# EAGLE design p4_joint (EAGLE 9.6.2)
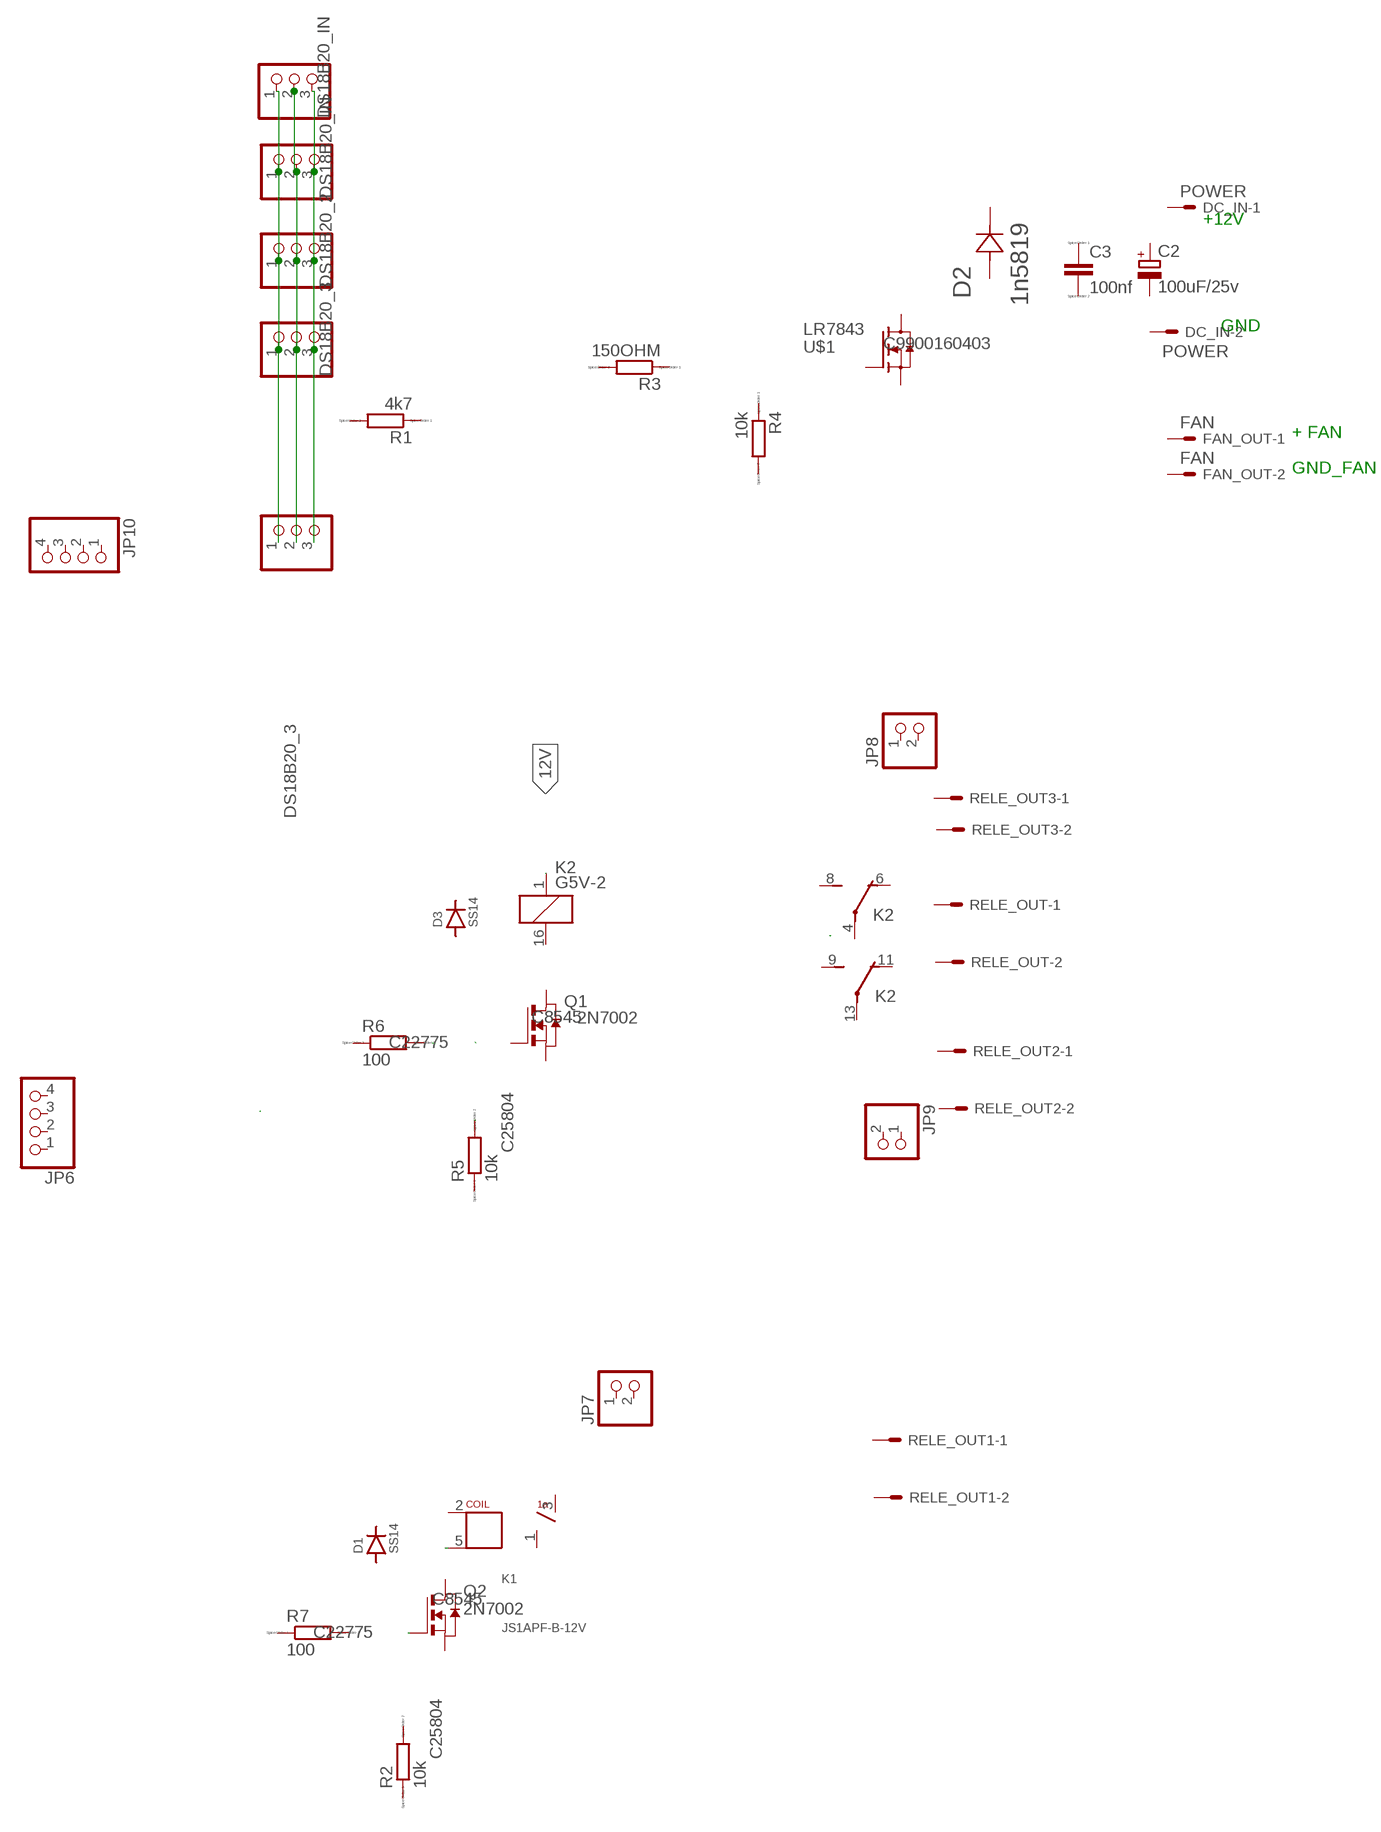
[diagram p0: schematic, sheet 1]

## Parts
C2  100uF/25v  CPOL-EUC  [PANASONIC_C]
C3  100nf  CC0603  [C0603]
D1  SS14  [SMA]
D2  1n5819  1N4148W-7-FSOD123-M  [SOD123-M]
D3  SS14  [SMA]
DC_IN  POWER  KK-156-2  [KK-156-2]
FAN_OUT  FAN  KK-156-2  [KK-156-2]
JP1  DS18B20_IN  PINHD-1X3  [1X03]
JP2  DS18B20_IN  PINHD-1X3  [1X03]
JP3  DS18B20_3  PINHD-1X3  [1X03]
JP4  DS18B20_2  PINHD-1X3  [1X03]
JP5  DS18B20_3  PINHD-1X3  [1X03]
JP6  PINHD-1X4  [1X04]
JP7  PINHD-1X2  [1X02]
JP8  PINHD-1X2  [1X02]
JP9  PINHD-1X2  [1X02]
JP10  PINHD-1X4  [1X04]
K1  JS1APF-B-12V  [JS_RELAY_1A]
K2  G5V-2  [G5V-2]
Q1  2N7002  NMOSSOT23  [SOT-23]
Q2  2N7002  NMOSSOT23  [SOT-23]
R1  4k7  RR0603  [R0603]
R2  10k  R  [R0805]
R3  150OHM  RR0603  [R0603]
R4  10k  RR0603  [R0603]
R5  10k  R  [R0805]
R6  100  R  [R0805]
R7  100  R  [R0805]
RELE_OUT  KK-156-2  [KK-156-2]
RELE_OUT1  KK-156-2  [KK-156-2]
RELE_OUT2  KK-156-2  [KK-156-2]
RELE_OUT3  KK-156-2  [KK-156-2]
U$1  LR7843  IRLR7843  [TO252]

## Nets
12V: K2.1
N$2: JP1.3 JP2.3 JP3.3 JP4.3 JP5.3
N$5: R5.2
N$6: Q2.3(G)
N$11: R6.2
N$12: K1.5(C2)
N$21: JP1.2 JP2.2 JP3.2 JP4.2 JP5.2
N$22: JP1.1 JP2.1 JP3.1 JP4.1 JP5.1
Unconnected: C2.+ C2.- C3.1 C3.2 D1.A D1.C D2.A D2.C D3.A D3.C DC_IN.1 DC_IN.2 FAN_OUT.1 FAN_OUT.2 JP6.1 JP6.2 JP6.3 JP6.4 JP7.1 JP7.2 JP8.1 JP8.2 JP9.1 JP9.2 JP10.1 JP10.2 JP10.3 JP10.4 K1.1(COM) K1.2(C1) K1.3(NO) K2.4(1:P) K2.6(1:O) K2.8(1:S) K2.9(2:S) K2.11(2:O) K2.13(2:P) K2.16 Q1.1(D) Q1.2(S) Q1.3(G) Q2.1(D) Q2.2(S) R1.1 R1.2 R2.1 R2.2 R3.1 R3.2 R4.1 R4.2 R5.1 R6.1 R7.1 R7.2 RELE_OUT1.1 RELE_OUT1.2 RELE_OUT2.1 RELE_OUT2.2 RELE_OUT3.1 RELE_OUT3.2 RELE_OUT.1 RELE_OUT.2 U$1.1(G) U$1.2(S) U$1.3(D)

## Notes on the sheet
- +12V
- GND
- + FAN
- GND_FAN

## Library data of the parts
C2 = rcl:CPOL-EU: POLARIZED CAPACITOR, European symbol; SPICEPREFIX: C
C3 = eagle-ltspice:C: CAPACITOR, European symbol; SPICEMODEL: NONE; SPICEPREFIX: C
D1 D3 = p4_joint_add:SS14: Schottky 1A/40V SMA (DO-214AC). JLCPCB LCSC C2480 (basica). Catodo = pad C (banda).; LCSC: C2480
D2 = 1N4148W:1N4148W-7-F; COPYRIGHT: Copyright C 2015 Accelerated Designs. All rights reserved; MANUFACTURER_PART_NUMBER: 1N4148W7F; VENDOR: Diodes Inc
DC_IN FAN_OUT RELE_OUT RELE_OUT1-RELE_OUT3 = con-molex:KK-156-2: KK 156 HEADER Source: http://www.molex.com/pdm_docs/sd/026604100_sd.pdf; MF: MOLEX; OC_FARNELL: unknown; OC_NEWARK: unknown
JP1-JP5 = pinhead:PINHD-1X3: PIN HEADER
JP6 JP10 = pinhead:PINHD-1X4: PIN HEADER
JP7-JP9 = pinhead:PINHD-1X2: PIN HEADER
K1 = p4_joint_add:JS1APF-B-12V: Rele Panasonic JS1aPF-B-12V, 1 Form A. Bobina 12V/400ohm/30mA. THT, a mano. FOOTPRINT PROVISIONAL.
K2 = relay:G5V-2: OMRON PCB Relay Source: http://www.omron.com/ecb/products/pdf/en-g5v2.pdf; MPN: G5V-2 5DC; OC_FARNELL: 9949488; OC_NEWARK: 78K5703
Q1 Q2 = zetex:NMOSSOT23: MOS FET; LCSC: C8545; OC_FARNELL: unknown; OC_NEWARK: unknown
R1 R3 R4 = eagle-ltspice:R: RESISTOR, European symbol; SPICEMODEL: NONE; SPICEPREFIX: R
R2 R5 = eagle-ltspice:R: RESISTOR, European symbol; LCSC: C25804; SPICEMODEL: NONE; SPICEPREFIX: R
R6 R7 = eagle-ltspice:R: RESISTOR, European symbol; LCSC: C22775; SPICEMODEL: NONE; SPICEPREFIX: R
U$1 = IRLR7843:IRLR7843; LCSC: C9900160403

## Board
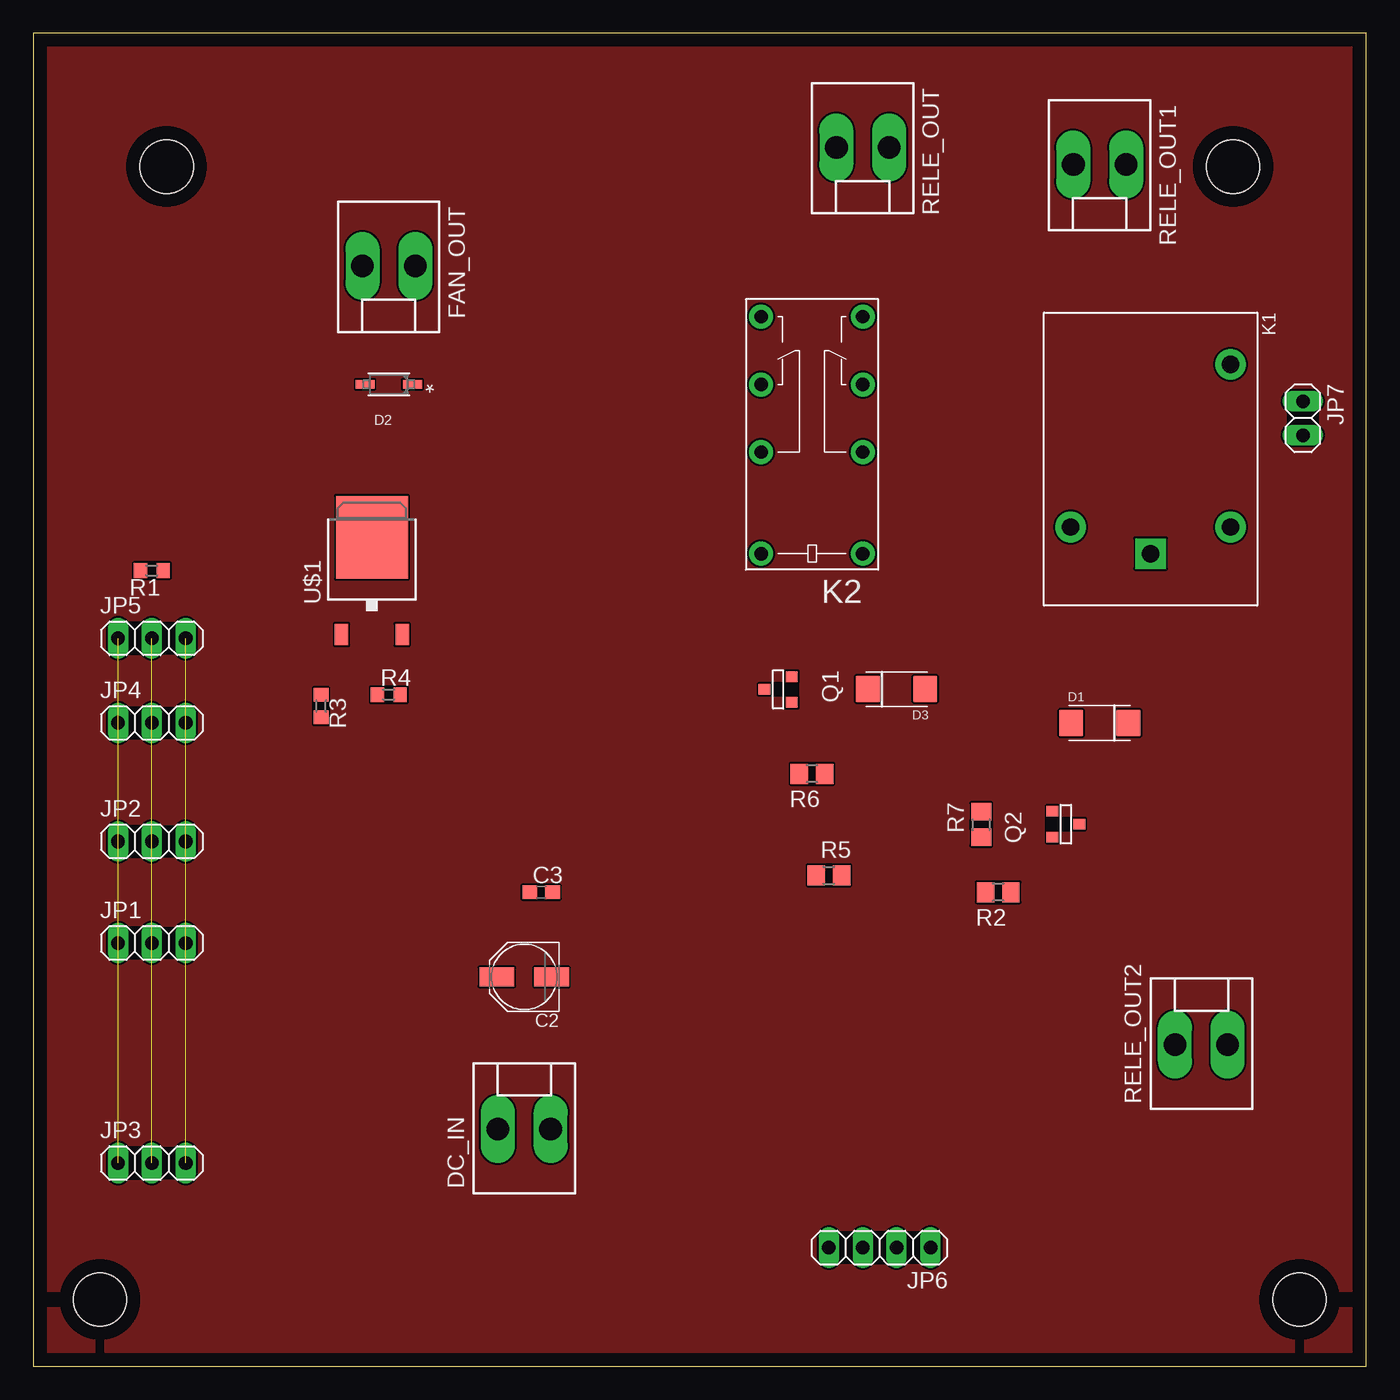
[diagram p1: board, top side]
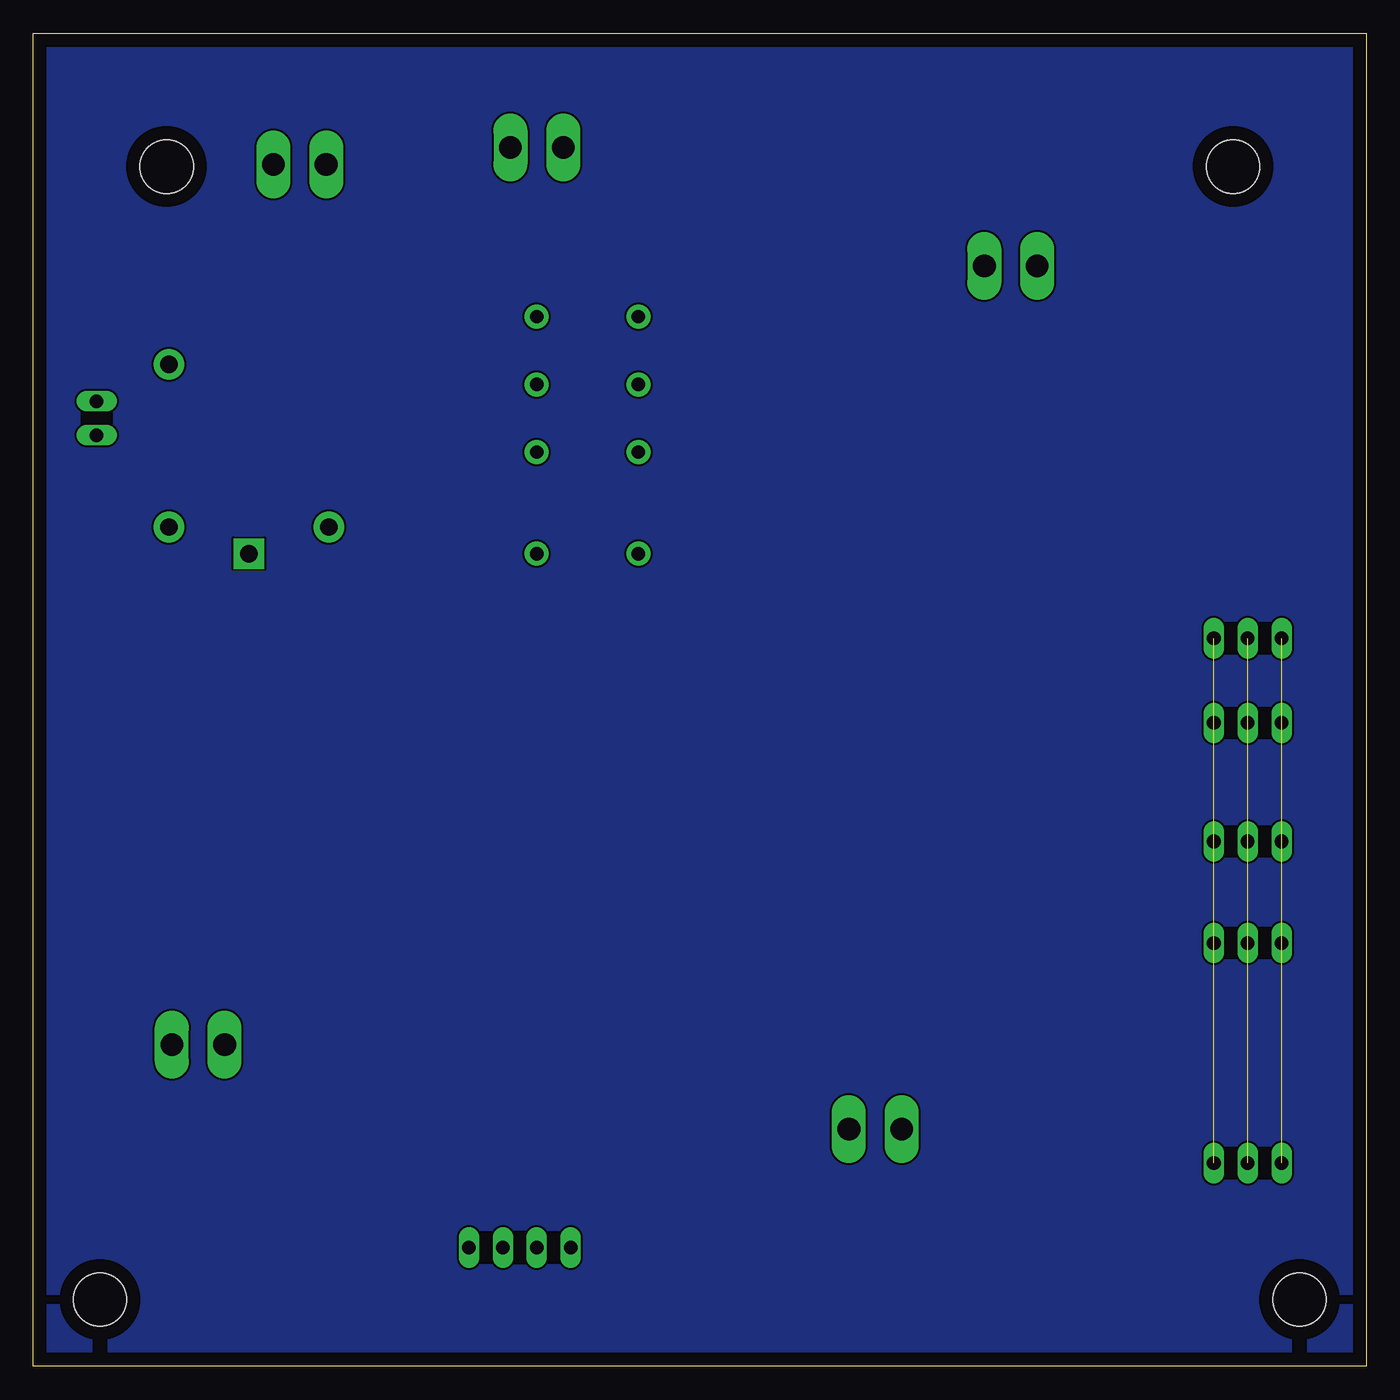
[diagram p2: board, bottom side, seen from below]

Size 100 x 100 mm. Coordinates in mm from the lower left corner, seen from the top.
Outline: 0,0 100,0 100,100 0,100 0,0
Copper layers (1*16): Top 0.035mm / dielectric 1.5mm / Bottom 0.035mm
Design rules "default": minimum track width 6mil, minimum drill 0.35mm, track to track 6mil, track to pad 6mil, pad to pad 6mil, via to via 6mil, smd to smd 6mil, copper to edge 40mil, drill to drill 6mil, minimum pad ring 10mil, minimum via ring 8mil, stop-mask expansion 4mil, vias tented up to drill 0mil, thermal gap 10mil
Holes 4 mm at 10,90 90,90 5,5 95,5

### Footprints (pad centres in the part's own frame; a part is rotated, then mirrored left to right if it is on the bottom)
PANASONIC_C = smd 2.6 x 1.4: + 2.05,0; - -2.05,0
C0603 = smd 1.1 x 1: 1 -0.85,0; 2 0.85,0
SMA = smd 1.8 x 2: A -2.15,0; C 2.15,0
SOD123-M = smd 1.416 x 0.652: A 1.776,0; C -1.776,0
KK-156-2 = drill 1.7 pad 2.184 long: 1 -1.98,0; 2 1.98,0
1X03 = drill 1.016 long: 1 -2.54,0; 2 0,0; 3 2.54,0
1X04 = drill 1.016 long: 1 -3.81,0; 2 -1.27,0; 3 1.27,0; 4 3.81,0
1X02 = drill 1.016 long: 1 -1.27,0; 2 1.27,0
JS_RELAY_1A = drill 1.3 pad 2.3 square: 1 0,0 | drill 1.3 pad 2.3: 2 -2,6; 3 -14.2,6; 5 -2,-6
G5V-2 = drill 1 pad 1.8: 1 -8.89,-3.81; 4 -1.27,-3.81; 6 3.81,-3.81; 8 8.89,-3.81; 9 8.89,3.81; 11 3.81,3.81; 13 -1.27,3.81; 16 -8.89,3.81
SOT-23 = smd 0.787 x 0.889: 1 0.025,-1.016; 2 -0.94,1.016; 3 0.991,1.016
R0603 = smd 1 x 1.1: 1 -0.85,0; 2 0.85,0
R0805 = smd 1.3 x 1.5: 1 -0.95,0; 2 0.95,0
TO252 = smd 1 x 1.6: 1 -2.28,-4.8; 2 2.28,-4.8 | smd 5.4 x 6.2: 3 0,2.5

### Placement (x,y rotation side)
C2  36.83,29.21 180 top
C3  38.1,35.56 0 top
D1  80.01,48.26 0 top
D2  26.67,73.66 180 top
D3  64.77,50.8 180 top
DC_IN  36.83,17.78 0 top
FAN_OUT  26.67,82.55 180 top
JP1  8.89,31.75 0 top
JP2  8.89,39.37 0 top
JP3  8.89,15.24 0 top
JP4  8.89,48.26 0 top
JP5  8.89,54.61 0 top
JP6  63.5,8.89 180 top
JP7  95.25,71.12 270 top
JP8  2.54,-135.89 0 top  (outside the outline)
JP9  2.54,-142.24 0 top  (outside the outline)
JP10  5.08,-158.75 0 top  (outside the outline)
K1  83.82,60.96 270 top
K2  58.42,69.85 90 top
Q1  55.88,50.8 270 top
Q2  77.47,40.64 90 top
R1  8.89,59.69 180 top
R2  72.39,35.56 180 top
R3  21.59,49.53 270 top
R4  26.67,50.38 0 top
R5  59.69,36.83 0 top
R6  58.42,44.45 180 top
R7  71.12,40.64 90 top
RELE_OUT  62.23,91.44 180 top
RELE_OUT1  80.01,90.17 180 top
RELE_OUT2  87.63,24.13 0 top
RELE_OUT3  6.35,-149.86 0 top  (outside the outline)
U$1  25.4,59.69 0 top

### Tracks (layer width: path | path; a pad name or v marks a point on that pad's centre or on a via)
GND
  pour Top: 0,100 100,100 100,0 0,0
  pour Bottom: 0,100 100,100 100,0 0,0
N$2  (4 unrouted)
N$21  (4 unrouted)
N$22  (4 unrouted)